# Altium schematic sheet Power Management.SchDoc
size B; SheetNumber: 3; SheetTotal: 4
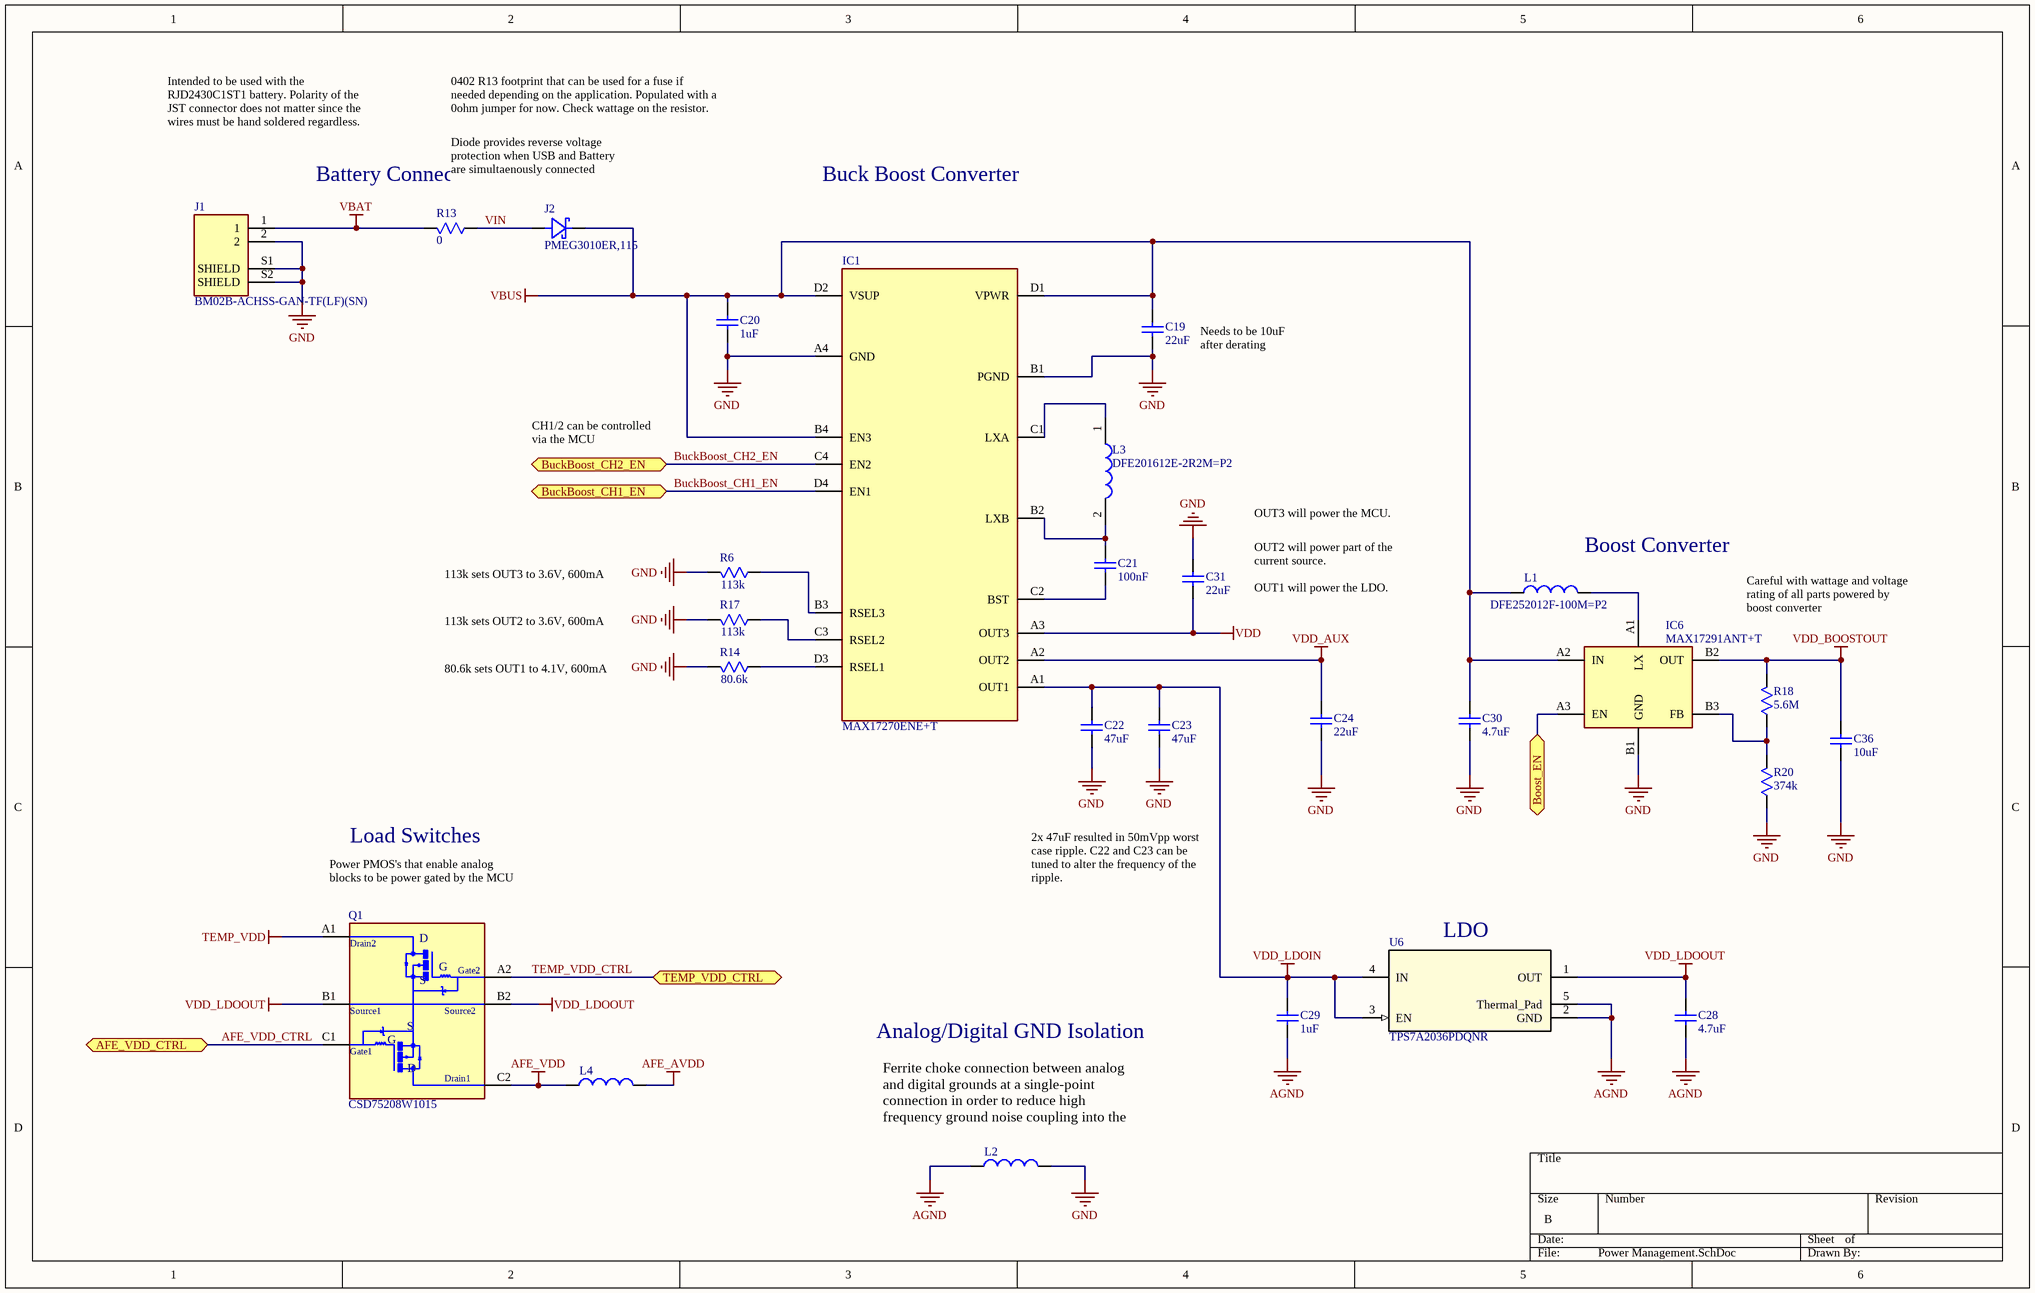
[diagram p0: Power Management.SchDoc]

## Parts
C19  value 22uF  [0402-CAP]  (hidden comment: CAP)
C20  value 1uF  [0201 cap]  (hidden comment: CAP)
C21  value 100nF  [0201 cap]  (hidden comment: CAP)
C22  value 47uF  [0603-CAP]  (hidden comment: CAP)
C23  value 47uF  [0603-CAP]  (hidden comment: CAP)
C24  value 22uF  [0402-CAP]  (hidden comment: CAP)
C28  value 4.7uF  [0201 cap]  (hidden comment: CAP)
C29  value 1uF  [0201 cap]  (hidden comment: CAP)
C30  value 4.7uF  [0201 cap]  (hidden comment: CAP)
C31  value 22uF  [0402-CAP]  (hidden comment: CAP)
C36  value 10uF  [0603-CAP]  (hidden comment: CAP)
IC1  MAX17270ENE+T  [BGA16C40P4X4_177X177X50]
IC6  MAX17291ANT+T  [Maxim_Integrated_N60N1-1_MFG]
J1  BM02B-ACHSS-GAN-TF(LF)(SN)  [JST_BM02B-ACHSS-GAN-TF(LF)(SN)]
J2  PMEG3010ER,115  [SDO_SOD-123FL_ONS-L]
L1  DFE252012F-100M=P2  [INDC2520X120N]
L2  IND  [0201 ferrite]  (value not drawn)
L3  DFE201612E-2R2M=P2  [1286ASH1R0MP2]
L4  IND  [0201 ferrite]  (value not drawn)
Q1  CSD75208W1015  [BGA6C50P2X3_145X95X62]
R6  value 113k  [0201 res]  (hidden comment: RES)
R13  value 0  [0402-RES]  (hidden comment: RES)
R14  value 80.6k  [0201 res]  (hidden comment: RES)
R17  value 113k  [0201 res]  (hidden comment: RES)
R18  value 5.6M  [0201 res]  (hidden comment: RES)
R20  value 374k  [0201 res]  (hidden comment: RES)
U6  TPS7A2036PDQNR  [DQN0004A-MFG]

## Ports
AFE_VDD_CTRL (bidir), Boost_EN (bidir), BuckBoost_CH1_EN (bidir), BuckBoost_CH2_EN (bidir), TEMP_VDD_CTRL (bidir)

## Nets
AFE_AVDD: L4.2
AFE_VDD: L4.1 Q1.C2(DRAIN1)
AGND: C28.2 C29.2 L2.1 U6.2(GND) U6.5(Thermal_Pad)
GND: C19.2 C20.2 C22.2 C23.2 C24.2 C30.2 C31.2 C36.2 IC1.A4(GND) IC1.B1(PGND) IC6.B1(GND) J1.2 J1.S1(SHIELD) J1.S2(SHIELD) L2.2 R6.2 R14.2 R17.2 R20.1
TEMP_VDD: Q1.A1(DRAIN2)
VBAT: J1.1 R13.2
VBUS: C19.1 C20.1 C30.1 IC1.B4(EN3) IC1.D1(VPWR) IC1.D2(VSUP) IC6.A2(IN) J2.1 L1.1
VDD: C31.1 IC1.A3(OUT3)
VDD_AUX: C24.1 IC1.A2(OUT2)
VDD_BOOSTOUT: C36.1 IC6.B2(OUT) R18.2
VDD_LDOIN: C22.1 C23.1 C29.1 IC1.A1(OUT1) U6.3(EN) U6.4(IN)
VDD_LDOOUT: C28.1 Q1.B1(SOURCE1) Q1.B2(SOURCE2) U6.1(OUT)
AFE_VDD_CTRL: Q1.C1(GATE1) ; port AFE_VDD_CTRL
Boost_EN: IC6.A3(EN) ; port Boost_EN
BuckBoost_CH1_EN: IC1.D4(EN1) ; port BuckBoost_CH1_EN
BuckBoost_CH2_EN: IC1.C4(EN2) ; port BuckBoost_CH2_EN
TEMP_VDD_CTRL: Q1.A2(GATE2) ; port TEMP_VDD_CTRL
VIN: J2.2 R13.1
NetC21_1: C21.1 IC1.B2(LXB) L3.2
NetC21_2: C21.2 IC1.C2(BST)
NetIC1_B3: IC1.B3(RSEL3) R6.1
NetIC1_C1: IC1.C1(LXA) L3.1
NetIC1_C3: IC1.C3(RSEL2) R17.1
NetIC1_D3: IC1.D3(RSEL1) R14.1
NetIC6_A1: IC6.A1(LX) L1.2
NetIC6_B3: IC6.B3(FB) R18.1 R20.2

## Notes on the sheet
- Intended to be used with the RJD2430C1ST1 battery. Polarity of the JST connector does not matter since the wires must be hand soldered regardless.
- 0402 R13 footprint that can be used for a fuse if needed depending on the application. Populated with a 0ohm jumper for now. Check wattage on the resistor.
- (near J1) Battery Connector
- Diode provides reverse voltage protection when USB and Battery are simultaenously connected
- Buck Boost Converter
- (near C19) Needs to be 10uF after derating
- CH1/2 can be controlled via the MCU
- OUT3 will power the MCU.
- OUT2 will power part of the current source.
- (near L1) Boost Converter
- 113k sets OUT3 to 3.6V, 600mA limit
- 113k sets OUT2 to 3.6V, 600mA limit
- OUT1 will power the LDO.
- Careful with wattage and voltage rating of all parts powered by boost converter
- 80.6k sets OUT1 to 4.1V, 600mA limit
- (near Q1) Power PMOS's that enable analog blocks to be power gated by the MCU
- Load Switches
- 2x 47uF resulted in 50mVpp worst case ripple. C22 and C23 can be tuned to alter the frequency of the ripple.
- (near U6) LDO
- Analog/Digital GND Isolation
- (near L2) Ferrite choke connection between analog and digital grounds at a single-point connection in order to reduce high frequency ground noise coupling into the AFE.
- (in symbol CSD75208W1015) D; Drain2; G; Gate2; S; Source1; Source2; Gate1; Drain1

## Library data of the parts
C19-C24 C28-C31 C36 = CAP SMD: Multilayer Chip Capacitor; Designer: OMIGA
IC1 = MAX17270ENE+T: nanoPower Triple-Output, Single-Inductor, / Multiple-Output (SIMO) Buck-Boost Regulator; Manufacturer_Name: Maxim Integrated; Datasheet Link: https://pdfserv.maximintegrated.com/en/ds/MAX17270-MAX17271.pdf; Height: 0.5mm; Manufacturer_Part_Number: MAX17270ENE+T
IC6 = MAX17291ANT+T: Integrated Circuit; Manufacturer_Name: Analog Devices; Datasheet Link: https://datasheets.maximintegrated.com/en/ds/MAX17291.pdf; Height: 0.5mm; Manufacturer_Part_Number: MAX17291ANT+T; Mouser Part Number: 700-MAX17291ANT+T; Mouser Price/Stock: https://www.mouser.co.uk/ProductDetail/Maxim-Integrated/MAX17291ANT%2bT?qs=zW32dvEIR3vWkhPvj9WnJw%3D%3D; Arrow Part Number: MAX17291ANT+T; Arrow Price/Stock: https://www.arrow.com/en/products/max17291antt/maxim-integrated?region=nac
J1 = BM02B-ACHSS-GAN-TF(LF)(SN): Connector Header Surface Mount, Right Angle 2 position 0.047 (1.20mm); MF: JST Sales; Value: *; MP: BM02B-ACHSS-GAN-TF(LF)(SN); Package: None; Check_prices: https://www.snapeda.com/parts/BM02B-ACHSS-GAN-TF(LF)(SN)/JST+Sales+America+Inc./view-part/?ref=eda; Price: None; Purchase-URL: https://pricing.snapeda.com/search/part/BM02B-ACHSS-GAN-TF(LF)(SN)/?ref=eda; SnapEDA_Link: https://www.snapeda.com/parts/BM02B-ACHSS-GAN-TF(LF)(SN)/JST+Sales+America+Inc./view-part/?ref=snap; Availability: In Stock
J2 = SCHOTTKY_LowVf
L1 = DFE252012F-100M=P2: Inductor with Inductance: 10uH Tol. +/-20%, Package: 1008 (2520); MF: Murata Electronics; SnapEDA_Link: https://www.snapeda.com/parts/DFE252012F-100M=P2/Murata%20Electronics%20North%20America/view-part/1498782/?ref=snap; Value: *; Digi-Key_Part_Number: 490-13050-1-ND; Mouser-Purchase-URL: https://snapeda.com/shop?store=Mouser&id=1498782; MP: DFE252012F-100M=P2; DigiKey-Purchase-URL: https://snapeda.com/shop?store=DigiKey&id=1498782; Package: 2520 Murata
L2 L4 = IND SMD: Surface Mount Inductor; Designer: OMIGA
L3 = DFE201612E-2R2M=P2: Inductor; Manufacturer_Name: Murata Electronics; Datasheet Link: https://componentsearchengine.com//DFE201612E-2R2M=P2.pdf; Height: 1.2mm; Mouser2 Part Number: 81-DFE201612E-2R2MP2; Mouser2 Price/Stock: https://www.mouser.com/Search/Refine.aspx?Keyword=81-DFE201612E-2R2MP2; Manufacturer_Part_Number: DFE201612E-2R2M=P2
Q1 = CSD75208W1015: -20-V, P channel NexFETâ„¢ power MOSFET, dual Common Source WLP 1 mm x 1.5 mm, 108 mOhm, gate ESD prot; MF: Texas Instruments; SnapEDA_Link: https://www.snapeda.com/parts/CSD75208W1015/Texas+Instruments/view-part/?ref=snap; Price: None; Check_prices: https://www.snapeda.com/parts/CSD75208W1015/Texas+Instruments/view-part/?ref=eda; Value: *; Package: DSBGA-6 Texas Instruments; Availability: In Stock; Purchase-URL: https://pricing.snapeda.com/search/part/CSD75208W1015/?ref=eda; MP: CSD75208W1015
R6 R13 R14 R17 R18 R20 = RES SMD: Surface Mount Resistor; Designer: OMIGA
U6 = TPS7A2036PDQNR: No Description Available; Mfr_Name: Texas Instruments; Type: DEV; RefDes: RefDes; Copyright: Copyright (C) 2022 Ultra Librarian. All rights reserved.; Manufacturer_Part_Number: TPS7A2036PDQNR